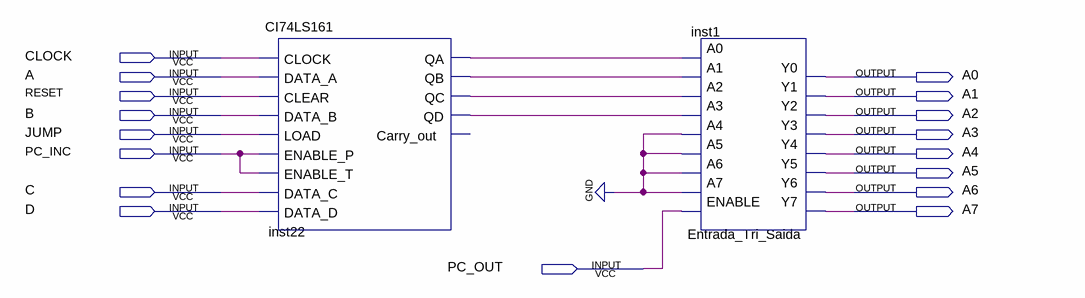
[diagram p0: schematic sheet]
// Quartus schematic Contador_de_programa.bdf as structural Verilog: 2 symbols, 17 pins
module Contador_de_programa (
  input  CLOCK,
  input  A,
  input  RESET,
  input  B,
  input  JUMP,
  input  PC_INC,
  input  C,
  input  D,
  input  PC_OUT,
  output A0,
  output A1,
  output A2,
  output A3,
  output A4,
  output A5,
  output A6,
  output A7
);

  wire inst22_qa, inst22_qb, inst22_qc, inst22_qd;

  CI74LS161 inst22 (
    .CLOCK(CLOCK), .DATA_A(A), .CLEAR(RESET), .DATA_B(B), .LOAD(JUMP), .ENABLE_P(PC_INC), .ENABLE_T(PC_INC),
    .DATA_C(C), .DATA_D(D), .QA(inst22_qa), .QB(inst22_qb), .QC(inst22_qc), .QD(inst22_qd));  // open: Carry_out
  Entrada_Tri_Saida inst1 (
    .ENABLE(PC_OUT), .A7(1'b0), .A6(1'b0), .A5(1'b0), .A4(1'b0), .A3(inst22_qd), .A2(inst22_qc),
    .A1(inst22_qb), .A0(inst22_qa), .Y7(A7), .Y6(A6), .Y5(A5), .Y4(A4), .Y3(A3), .Y2(A2), .Y1(A1), .Y0(A0));
endmodule
